# Altium schematic sheet Transmitter.SchDoc
size A3
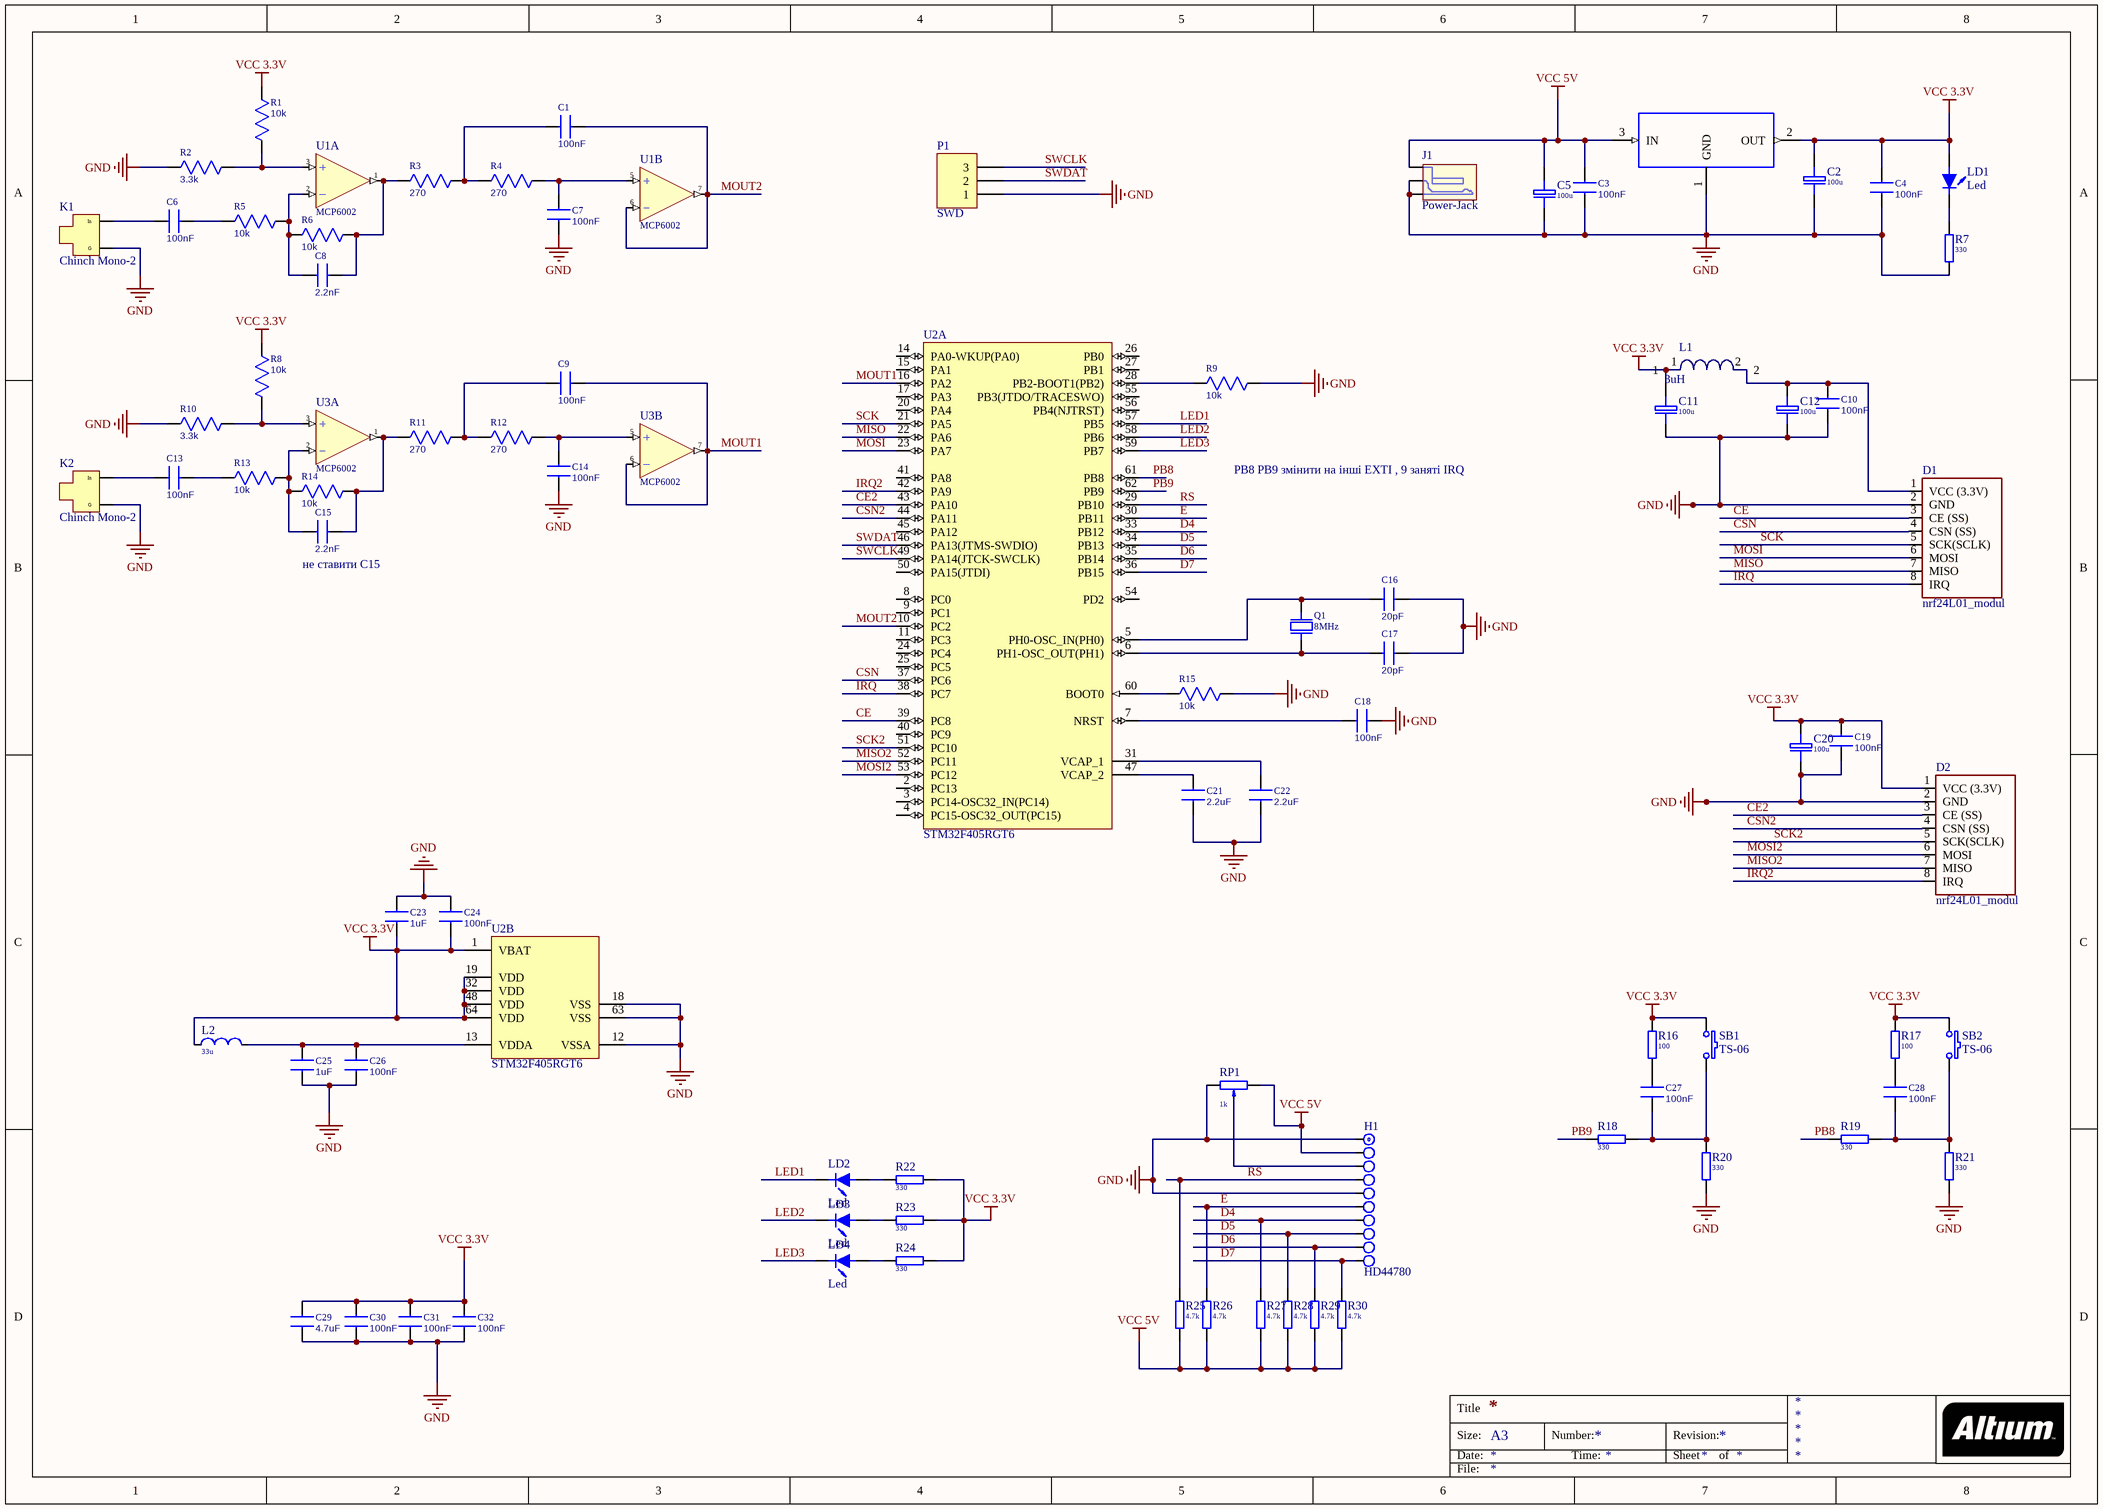
[diagram p0: Transmitter.SchDoc]

## Parts
1  AMS1117-3.3  [SOT-223_AMS1117-3.3(Primary)]  (value not drawn)
C1  100nF  [C_0805]
C2  100u  [El-d5-h11-F2.54]
C3  100nF  [C_0805]
C4  100nF  [C_0805]
C5  100u  [El-d5-h11-F2.54]
C6  100nF  [C_0805]
C7  100nF  [C_0805]
C8  value 2.2nF  [C_0805]  (hidden comment: 100nF)
C9  100nF  [C_0805]
C10  100nF  [C_0805]
C11  100u  [El-d5-h11-F2.54]
C12  100u  [El-d5-h11-F2.54]
C13  100nF  [C_0805]
C14  100nF  [C_0805]
C15  value 2.2nF  [C_0805]  (hidden comment: 100nF)
C16  20pF  [C_0805]
C17  20pF  [C_0805]
C18  100nF  [C_0805]
C19  100nF  [C_0805]
C20  100u  [El-d5-h11-F2.54]
C21  2.2uF  [C_0805]
C22  2.2uF  [C_0805]
C23  1uF  [C_0805]
C24  100nF  [C_0805]
C25  1uF  [C_0805]
C26  100nF  [C_0805]
C27  100nF  [C_0805]
C28  100nF  [C_0805]
C29  4.7uF  [C_0805]
C30  100nF  [C_0805]
C31  100nF  [C_0805]
C32  100nF  [C_0805]
D1  nrf24L01_modul  [24L01-2x4]
D2  nrf24L01_modul  [24L01-2x4]
H1  HD44780  [J1x10]
J1  Power-Jack  [Power-Jack]
K1  Chinch Mono-2  [Chinch Mono - 2]
K2  Chinch Mono-2  [Chinch Mono - 2]
L1  L_SMD_5mm  [L_SMD_4.8]  (value not drawn)
L2  33u  [Dr-SD-75]
LD1  Led  [Led d3mm Blue]
LD2  Led  [Led d3mm Blue]
LD3  Led  [Led d3mm Blue]
LD4  Led  [Led d3mm Blue]
P1  SWD  [HDR1X3]
Q1  8MHz  [HC49S]
R1  value 10k  [R_0805]  (hidden comment: 0)
R2  value 3.3k  [R_0805]  (hidden comment: 0)
R3  value 270  [R_0805]  (hidden comment: 0)
R4  value 270  [R_0805]  (hidden comment: 0)
R5  value 10k  [R_0805]  (hidden comment: 0)
R6  value 10k  [R_0805]  (hidden comment: 0)
R7  330  [R0805]
R8  value 10k  [R_0805]  (hidden comment: 0)
R9  value 10k  [R_0805]  (hidden comment: 0)
R10  value 3.3k  [R_0805]  (hidden comment: 0)
R11  value 270  [R_0805]  (hidden comment: 0)
R12  value 270  [R_0805]  (hidden comment: 0)
R13  value 10k  [R_0805]  (hidden comment: 0)
R14  value 10k  [R_0805]  (hidden comment: 0)
R15  value 10k  [R_0805]  (hidden comment: 0)
R16  100  [R0805]
R17  100  [R0805]
R18  330  [R0805]
R19  330  [R0805]
R20  330  [R0805]
R21  330  [R0805]
R22  330  [R0805]
R23  330  [R0805]
R24  330  [R0805]
R25  4.7k  [R0805]
R26  4.7k  [R0805]
R27  4.7k  [R0805]
R28  4.7k  [R0805]
R29  4.7k  [R0805]
R30  4.7k  [R0805]
RP1  1k  [R-Tr 6LV]
SB1  TS-06  [TS-06]
SB2  TS-06  [TS-06]
U1  MCP6002  [SO8-150]  (parts A,B of 2)
U2  STM32F405RGT6  [STM-LQFP64_N]  (parts A,B of 2)
U3  MCP6002  [SO8-150]  (parts A,B of 2)

## Nets
GND: 1.1(GND) C2.2 C3.1 C4.1 C5.2 C7.1 C10.1 C11.2 C12.2 C14.1 C16.1 C17.1 C18.1 C19.1 C20.2 C21.1 C22.1 C23.2 C24.2 C25.1 C26.1 C29.1 C30.1 C31.1 C32.1 D1.2(GND) D2.2(GND) H1.1 H1.5 J1.1 J1.2 K1.2(G) K2.2(G) P1.1 R2.1 R7.1 R9.1 R10.1 R15.1 R20.2 R21.2 RP1.1 U2.12(VSSA) U2.18(VSS) U2.63(VSS)
V+: U1.8(VCC_3.3V) U3.8(VCC_3.3V)
V-: U1.4(GND) U3.4(GND)
VCC 3.3V: 1.2(OUT) C2.1 C4.2 C11.1 C19.2 C20.1 C23.1 C24.1 C29.2 C30.2 C31.2 C32.2 D2.1(VCC_(3.3V)) L1.1 L2.1 LD1.1(A) R1.1 R8.1 R16.1 R17.1 R22.1 R23.1 R24.1 SB1.1 SB2.1 U2.1(VBAT) U2.19(VDD) U2.32(VDD) U2.48(VDD) U2.64(VDD)
VCC 5V: 1.3(IN) C3.2 C5.1 H1.2 J1.3 R25.2 R26.2 R27.2 R28.2 R29.2 R30.2 RP1.3
CE: D1.3(CE_(SS)) U2.39(PC8)
CE2: D2.3(CE_(SS)) U2.43(PA10)
CSN: D1.4(CSN_(SS)) U2.37(PC6)
CSN2: D2.4(CSN_(SS)) U2.44(PA11)
D4: H1.7 R27.1 U2.33(PB12)
D5: H1.8 R28.1 U2.34(PB13)
D6: H1.9 R29.1 U2.35(PB14)
D7: H1.10 R30.1 U2.36(PB15)
E: H1.6 R26.1 U2.30(PB11)
IRQ: D1.8(IRQ) U2.38(PC7)
IRQ2: D2.8(IRQ) U2.42(PA9)
LED1: LD2.2(K) U2.57(PB5)
LED2: LD3.2(K) U2.58(PB6)
LED3: LD4.2(K) U2.59(PB7)
MISO: D1.7(MISO) U2.22(PA6)
MISO2: D2.7(MISO) U2.52(PC11)
MOSI: D1.6(MOSI) U2.23(PA7)
MOSI2: D2.6(MOSI) U2.53(PC12)
MOUT1: C9.1 U2.16(PA2) U3.6(-IN) U3.7(OUT)
MOUT2: C1.1 U1.6(-IN) U1.7(OUT) U2.10(PC2)
PB8: R19.2 U2.61(PB8)
PB9: R18.2 U2.62(PB9)
RS: H1.4 R25.1 U2.29(PB10)
SCK: D1.5(SCK(SCLK)) U2.21(PA5)
SCK2: D2.5(SCK(SCLK)) U2.51(PC10)
SWCLK: P1.3 U2.49(PA14(JTCK-SWCLK))
SWDAT: P1.2 U2.46(PA13(JTMS-SWDIO))
NetC1_2: C1.2 R3.2 R4.1
NetC6_1: C6.1 K1.1(In)
NetC6_2: C6.2 R5.1
NetC7_2: C7.2 R4.2 U1.5(+IN)
NetC8_1: C8.1 R5.2 R6.1 U1.2(-IN)
NetC8_2: C8.2 R3.1 R6.2 U1.1(OUT)
NetC9_2: C9.2 R11.2 R12.1
NetC10_2: C10.2 C12.1 D1.1(VCC_(3.3V)) L1.2
NetC13_1: C13.1 K2.1(In)
NetC13_2: C13.2 R13.1
NetC14_2: C14.2 R12.2 U3.5(+IN)
NetC15_1: C15.1 R13.2 R14.1 U3.2(-IN)
NetC15_2: C15.2 R11.1 R14.2 U3.1(OUT)
NetC16_2: C16.2 Q1.1 U2.5(PH0-OSC_IN(PH0))
NetC17_2: C17.2 Q1.2 U2.6(PH1-OSC_OUT(PH1))
NetC18_2: C18.2 U2.7(NRST)
NetC21_2: C21.2 U2.47(VCAP_2)
NetC22_2: C22.2 U2.31(VCAP_1)
NetC25_2: C25.2 C26.2 L2.2 U2.13(VDDA)
NetC27_1: C27.1 R18.1 R20.1 SB1.2
NetC27_2: C27.2 R16.2
NetC28_1: C28.1 R19.1 R21.1 SB2.2
NetC28_2: C28.2 R17.2
NetH1_3: H1.3 RP1.2
NetLD1_2: LD1.2(K) R7.2
NetLD2_1: LD2.1(A) R22.2
NetLD3_1: LD3.1(A) R23.2
NetLD4_1: LD4.1(A) R24.2
NetR1_2: R1.2 R2.2 U1.3(+IN)
NetR8_2: R8.2 R10.2 U3.3(+IN)
NetR9_2: R9.2 U2.28(PB2-BOOT1(PB2))
NetR15_2: R15.2 U2.60(BOOT0)

Not connected (* = marked no-connect by the designer): U2 2(PC13) 3(PC14-OSC32_IN(PC14)) 4(PC15-OSC32_OUT(PC15)) 8(PC0) 9(PC1) 11(PC3) 14(PA0-WKUP(PA0)) 15(PA1) 17(PA3) 20(PA4) 24(PC4) 25(PC5) 26(PB0) 27(PB1) 40(PC9) 41(PA8) 45(PA12) 50(PA15(JTDI)) 54(PD2) 55(PB3(JTDO/TRACESWO)) 56(PB4(NJTRST))

## Notes on the sheet
- PB8 PB9 змінити на інші ЕХТІ , 9 заняті IRQ
- (near C15) не ставити С15
- Title
- Size:
- Date:
- A3
- Number:
- Time:
- Revision:
- Sheet
- of
- File:
- (in symbol L_SMD_5mm) 3uH

## Library data of the parts
C1 C3 C4 C6-C10 C13-C19 C21-C32 = C0805: Capacitor
  C1 C3 C4 C6 C7 C9 C10 C13 C14 C18 C19 C24 C26-C28 C30-C32: Value: 100nF
  C16 C17: Value: 20pF
  C21 C22: Value: 2.2uF
  C23 C25: Value: 1uF
  C29: Value: 4.7uF
C2 C5 C11 C12 C20 = 10u-35V: 35V; Price: 0.04; Value: 100u
H1 = H-1x10: Price: 0.1
L2 = L-SD-75 33uH: 1.2A 0.15om 7.3x7.3x5mm; Price: 0.85; Value: 33u
LD1-LD4 = Led 3mm Blue: 3mm; Price: 0.05
P1 = Header 3: Header, 3-Pin; LatestRevisionDate: 17-Jul-2002; LatestRevisionNote: Re-released for DXP Platform.; Publisher: Altium Limited
Q1 = Q: Typ: Qvarz 8 HC49S; Price: 0.45
R1-R6 R8-R15 = R0805: Resistor
R7 R16-R30 = R-0805: SMD 0805 0.1W 5% 150V; Price: 0.017
  R7 R18-R24: Value: 330
  R16 R17: Value: 100
  R25-R30: Value: 4.7k
RP1 = R-Tr 6LV: Тример 0,15W 6mm Вер. Piner; Set Position: 0.5; Price: 0.2; Value: 1k
SB1 SB2 = Buton TS-06: Price: 0.15
U1 U3 = MCP6072: CMOS 0.15mV 1.2MHz R/R In/Out 110uA; Price: 1.25
U2 = STM32F405RGT6: ARM Cortex-M4 32-bit MCU+FPU, 210 DMIPS, 1024 kB Flash, 192 kB Internal RAM, 51 I/Os, 64-pin LQFP, -40 to 85 degC, Tray; Manufacturer: STMicroelectronics; D/A Converter: 2x12-bit; FLASH Size (Prog) (kB): 1024; I/Os (High Current): 51; Internal RAM Size (kB): 192; Operating Frequency(F) (Processor speed) (MHz): 168; Supply Voltage(Vcc) max (V): 3.6; Supply Voltage(Vcc) min (V): 1.8; DatasheetVersion: Rev. 4; PackageVersion: Rev. 4, 06/2013; PackageReference: LQFP64; PackageDescription: 64-Pin Low Profile Quad Flat Package, 10 x 10 mm Body, 0.5 mm Pitch; Supplier 1: Digi-Key; Supplier Part Number 1: 497-11767-ND; Supplier 2: Farnell; Supplier Part Number 2: 2064363; Supplier 3: Newark; Supplier Part Number 3: 73T2329; Supplier 4: Mouser; Supplier Part Number 4: 511-STM32F405RGT6; Core: ARM Cortex-M4; Packing: Tray; Mounting Technology: Surface Mount; PartNumber: STM32F405RGT6; ComponentLink1Description: Manufacturer URL; ComponentLink1URL: http://www.st.com/web/en/home.html; ComponentLink2Description: Datasheet; ComponentLink2URL: http://www.st.com/st-web-ui/static/active/en/resource/technical/document/datasheet/DM00037051.pdf; ComponentLink3Description: Package Specification; ComponentLink3URL: http://www.st.com/st-web-ui/static/active/en/resource/technical/document/datasheet/DM00037051.pdf
1 = AMS1117-3.3: Value: *
K1 K2 = Chinch Mono-2: Price: 0.24